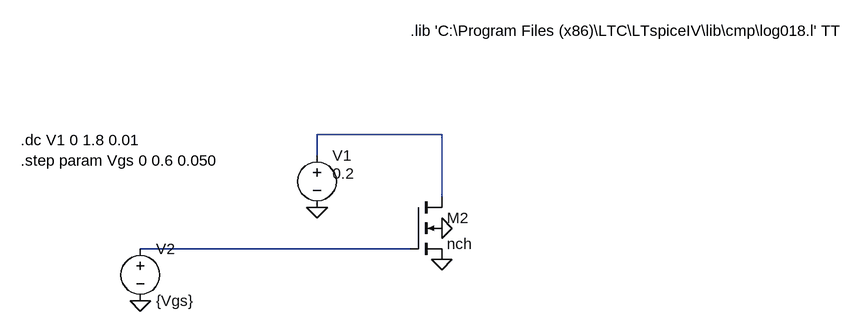
[diagram p0: schematic 180nm_parameters_NMOS.asc]
180nm_parameters_NMOS.asc, the LTspice schematic file:
Version 4
SHEET 1 1268 680
WIRE 512 32 320 32
WIRE 320 64 320 32
WIRE 512 128 512 32
WIRE 464 208 48 208
FLAG 320 144 0
FLAG 48 288 0
FLAG 512 224 0
FLAG 512 176 0
SYMBOL voltage 320 48 R0
WINDOW 123 0 0 Left 2
WINDOW 39 0 0 Left 2
WINDOW 3 24 44 Left 2
SYMATTR Value 0.2
SYMATTR InstName V1
SYMBOL voltage 48 192 R0
WINDOW 123 0 0 Left 2
WINDOW 39 0 0 Left 2
SYMATTR InstName V2
SYMATTR Value {Vgs}
SYMBOL nmos4 464 128 R0
SYMATTR InstName M2
SYMATTR Value nch
SYMATTR Value2 l=0.78u w=90u m=2
TEXT 464 -128 Left 2 !.lib 'C:\\Program Files (x86)\\LTC\\LTspiceIV\\lib\\cmp\\log018.l' TT
TEXT -136 40 Left 2 !.dc V1 0 1.8 0.01
TEXT -136 72 Left 2 !.step param Vgs 0 0.6 0.050

The netlist it stands for:
* 180nm_parameters_NMOS.asc
V1 N001 0 0.2
V2 N002 0 {Vgs}
M2 N001 N002 0 0 nch l=0.78u w=90u m=2
.model NMOS NMOS
.model PMOS PMOS
.lib standard.mos
.lib 'C:\Program Files (x86)\LTC\LTspiceIV\lib\cmp\log018.l' TT
.dc V1 0 1.8 0.01
.step param Vgs 0 0.6 0.050
.backanno
.end